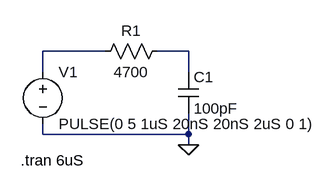
[diagram p0: schematic RC-Filter-Sim.asc]
RC-Filter-Sim.asc, the LTspice schematic file:
Version 4
SHEET 1 880 680
WIRE -48 32 -144 32
WIRE 80 32 32 32
WIRE -144 64 -144 32
WIRE 80 64 80 32
WIRE -144 160 -144 144
WIRE 80 160 80 128
WIRE 80 160 -144 160
WIRE 80 176 80 160
FLAG 80 176 0
SYMBOL res 48 16 R90
WINDOW 0 0 56 VBottom 2
WINDOW 3 32 56 VTop 2
SYMATTR InstName R1
SYMATTR Value 4700
SYMBOL cap 64 64 R0
SYMATTR InstName C1
SYMATTR Value 100pF
SYMBOL voltage -144 48 R0
WINDOW 123 0 0 Left 2
WINDOW 39 0 0 Left 2
SYMATTR InstName V1
SYMATTR Value PULSE(0 5 1uS 20nS 20nS 2uS 0 1)
TEXT -178 200 Left 2 !.tran 6uS

The netlist it stands for:
* RC-Filter-Sim.asc
R1 N002 N001 4700
C1 N002 0 100pF
V1 N001 0 PULSE(0 5 1uS 20nS 20nS 2uS 0 1)
.tran 6uS
.backanno
.end